# Altium schematic sheet Schema.SchDoc
size A4
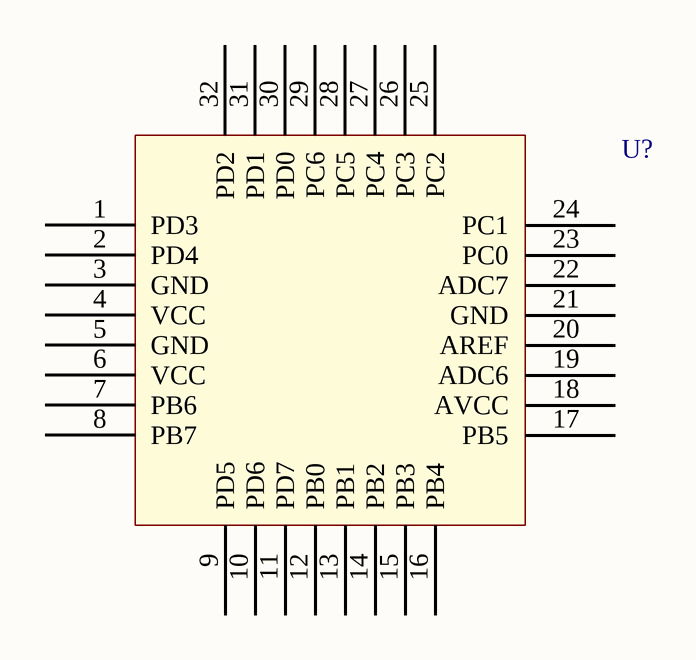
[diagram p0: Schema.SchDoc]

## Parts
U?  ATMEGA328P-MU  [QFN50P500X500X100_HS-33N]  (value not drawn)

## Nets

Not connected (* = marked no-connect by the designer): U? 1(PD3) 2(PD4) 3(GND) 4(VCC) 5(GND) 6(VCC) 7(PB6) 8(PB7) 9(PD5) 10(PD6) 11(PD7) 12(PB0) 13(PB1) 14(PB2) 15(PB3) 16(PB4) 17(PB5) 18(AVCC) 19(ADC6) 20(AREF) 21(GND) 22(ADC7) 23(PC0) 24(PC1) 25(PC2) 26(PC3) 27(PC4) 28(PC5) 29(PC6) 30(PD0) 31(PD1) 32(PD2)

## Library data of the parts
U? = ATMEGA328P-MU: MICROCHIP - ATMEGA328P-MU - MCU 8BIT, AVR, 32K FLASH, 32QFN; Interface: I2C,SPI,UART,USART; Peripherals: Brown-out Detect/Reset,POR,PWM,WDT; Frequency: 20MHz; Number of I/Os: 23; Memory Size: 32KB; Oscillator Type: Internal; Supplier 1: Digi-Key; Manufacturer: Microchip; Manufacturer Part Number: ATMEGA328P-MU; RoHS: No; Category: Microcontrollers; Stock 1: 5700; Pricing 1: 1=2,01000, 25=1,84000, 100=1,67000 (USD); Case/Package: VQFN; Min Operating Temperature: -40°C; Max Operating Temperature: 85°C; Memory Type: FLASH; Packaging: Tray; Core Architecture: AVR; ComponentLink1URL: http://www.farnell.com/datasheets/2047852.pdf?src-supplier=Farnell; ComponentLink1Description: http://www.farnell.com/datasheets/2047852.pdf?src-supplier=Farnell; ComponentLink2URL: http://www.microchip.com/mymicrochip/filehandler.aspx?ddocname=en589968&src-supplier=Digi-Key; ComponentLink2Description: http://www.microchip.com/mymicrochip/filehandler.aspx?ddocname=en589968&src-supplier=Digi-Key; ComponentLink3URL: http://www.farnell.com/datasheets/798182.pdf?src-supplier=Newark; ComponentLink3Description: http://www.farnell.com/datasheets/798182.pdf?src-supplier=Newark; ComponentLink4URL: http://www.farnell.com/datasheets/2047852.pdf?src-supplier=Element14; ComponentLink4Description: http://www.farnell.com/datasheets/2047852.pdf?src-supplier=Element14; Supplier Part Number 1: ATMEGA328P-MU-ND